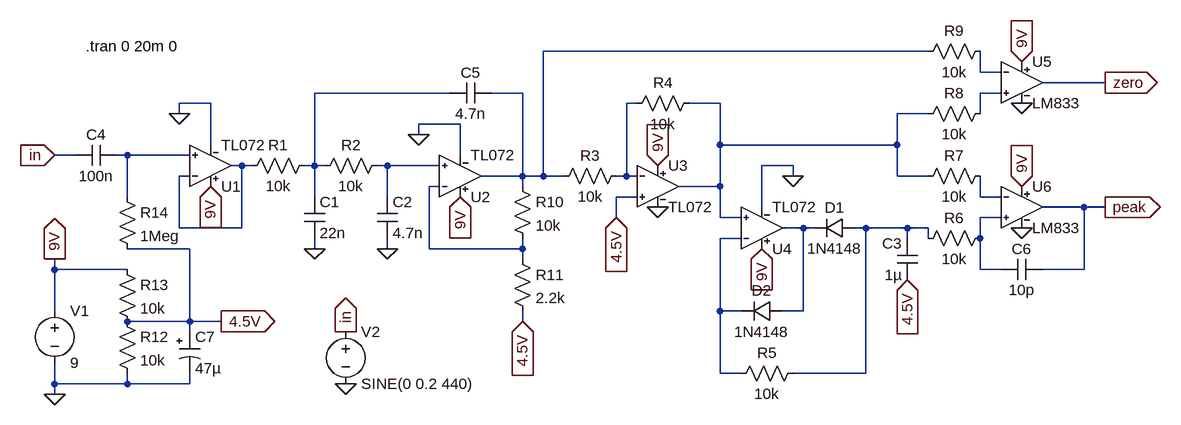
[diagram p0: schematic analyser.asc]
analyser.asc, the LTspice schematic file:
Version 4
SHEET 1 1392 772
WIRE 1024 144 432 144
WIRE 1104 176 1104 144
WIRE 1136 176 1104 176
WIRE 1296 192 1200 192
WIRE 288 208 80 208
WIRE 400 208 352 208
WIRE 1136 208 1104 208
WIRE -80 224 -128 224
WIRE 576 224 560 224
WIRE 704 224 656 224
WIRE -128 240 -128 224
WIRE 1024 240 976 240
WIRE 1104 240 1104 208
WIRE 304 256 240 256
WIRE 240 272 240 256
WIRE -80 288 -80 224
WIRE 704 288 704 224
WIRE 976 288 976 240
WIRE 976 288 704 288
WIRE -288 304 -320 304
WIRE -208 304 -224 304
WIRE -112 304 -208 304
WIRE 304 304 304 256
WIRE -32 320 -48 320
WIRE -16 320 -32 320
WIRE 80 320 80 208
WIRE 80 320 64 320
WIRE 96 320 80 320
WIRE 192 320 176 320
WIRE 272 320 192 320
WIRE 816 320 768 320
WIRE -112 336 -128 336
WIRE 400 336 400 208
WIRE 400 336 336 336
WIRE 432 336 432 144
WIRE 432 336 400 336
WIRE 464 336 432 336
WIRE 560 336 560 224
WIRE 560 336 544 336
WIRE 576 336 560 336
WIRE 816 336 816 320
WIRE 976 336 976 288
WIRE 1024 336 976 336
WIRE 272 352 256 352
WIRE 400 352 400 336
WIRE 704 352 704 288
WIRE 704 352 640 352
WIRE -208 368 -208 304
WIRE 80 368 80 320
WIRE 192 368 192 320
WIRE 576 368 544 368
WIRE 1104 368 1104 336
WIRE 1136 368 1104 368
WIRE 768 384 768 320
WIRE 1264 384 1200 384
WIRE 1296 384 1264 384
WIRE 544 400 544 368
WIRE 704 400 704 352
WIRE 736 400 704 400
WIRE 1136 400 1104 400
WIRE -128 416 -128 336
WIRE -32 416 -32 320
WIRE -32 416 -128 416
WIRE 832 416 800 416
WIRE 848 416 832 416
WIRE 928 416 912 416
WIRE 992 416 928 416
WIRE 1024 416 992 416
WIRE 736 432 704 432
WIRE 992 432 992 416
WIRE 1024 432 1024 416
WIRE 1104 432 1104 400
WIRE -112 448 -208 448
WIRE 80 448 80 432
WIRE 192 448 192 432
WIRE 256 448 256 352
WIRE 400 448 400 432
WIRE 400 448 256 448
WIRE 400 464 400 448
WIRE -320 480 -320 464
WIRE -208 480 -320 480
WIRE 1104 480 1104 432
WIRE 1136 480 1104 480
WIRE 1264 480 1264 384
WIRE 1264 480 1200 480
WIRE -320 544 -320 480
WIRE 704 544 704 432
WIRE 736 544 704 544
WIRE 832 544 832 416
WIRE 832 544 800 544
WIRE -112 560 -112 448
WIRE -112 560 -208 560
WIRE -64 560 -112 560
WIRE 400 560 400 544
WIRE -112 576 -112 560
WIRE 704 640 704 544
WIRE 736 640 704 640
WIRE 928 640 928 416
WIRE 928 640 816 640
WIRE -320 656 -320 624
WIRE -208 656 -208 640
WIRE -208 656 -320 656
WIRE -112 656 -112 640
WIRE -112 656 -208 656
WIRE -320 672 -320 656
FLAG -80 352 9V
IOPIN -80 352 In
FLAG 80 448 0
FLAG 192 448 0
FLAG 304 368 9V
IOPIN 304 368 In
FLAG 400 560 4.5V
IOPIN 400 560 In
FLAG 608 320 9V
IOPIN 608 320 In
FLAG 544 400 4.5V
IOPIN 544 400 In
FLAG 768 448 9V
IOPIN 768 448 In
FLAG 992 496 4.5V
IOPIN 992 496 In
FLAG 1296 192 zero
IOPIN 1296 192 Out
FLAG 1296 384 peak
IOPIN 1296 384 Out
FLAG -320 672 0
FLAG -320 464 9V
IOPIN -320 464 Out
FLAG 1168 160 9V
IOPIN 1168 160 In
FLAG 1168 352 9V
IOPIN 1168 352 In
FLAG 1168 224 0
FLAG 1168 416 0
FLAG 608 384 0
FLAG 240 272 0
FLAG -128 240 0
FLAG 816 336 0
FLAG -64 560 4.5V
IOPIN -64 560 Out
FLAG 128 576 in
IOPIN 128 576 Out
FLAG 128 656 0
FLAG -320 304 in
IOPIN -320 304 In
SYMBOL TL072 -80 384 M180
SYMATTR InstName U1
SYMBOL Res 80 304 R90
WINDOW 0 0 56 VBottom 2
WINDOW 3 32 56 VTop 2
SYMATTR InstName R1
SYMATTR Value 10k
SYMBOL Res 192 304 R90
WINDOW 0 0 56 VBottom 2
WINDOW 3 32 56 VTop 2
SYMATTR InstName R2
SYMATTR Value 10k
SYMBOL TL072 304 400 M180
SYMATTR InstName U2
SYMBOL TL072 608 288 R0
SYMATTR InstName U3
SYMBOL Res 560 320 R90
WINDOW 0 0 56 VBottom 2
WINDOW 3 32 56 VTop 2
SYMATTR InstName R3
SYMATTR Value 10k
SYMBOL TL072 768 480 M180
SYMATTR InstName U4
SYMBOL LM833 1168 128 R0
SYMATTR InstName U5
SYMBOL LM833 1168 320 R0
SYMATTR InstName U6
SYMBOL Cap 64 368 R0
SYMATTR InstName C1
SYMATTR Value 22n
SYMBOL Cap 176 368 R0
SYMATTR InstName C2
SYMATTR Value 4.7n
SYMBOL Res 672 208 R90
WINDOW 0 0 56 VBottom 2
WINDOW 3 32 56 VTop 2
SYMATTR InstName R4
SYMATTR Value 10k
SYMBOL Res 832 624 R90
WINDOW 0 0 56 VBottom 2
WINDOW 3 32 56 VTop 2
SYMATTR InstName R5
SYMATTR Value 10k
SYMBOL Res 1120 416 R90
WINDOW 0 0 56 VBottom 2
WINDOW 3 32 56 VTop 2
SYMATTR InstName R6
SYMATTR Value 10k
SYMBOL Res 1120 320 R90
WINDOW 0 0 56 VBottom 2
WINDOW 3 32 56 VTop 2
SYMATTR InstName R7
SYMATTR Value 10k
SYMBOL Res 1120 224 R90
WINDOW 0 0 56 VBottom 2
WINDOW 3 32 56 VTop 2
SYMATTR InstName R8
SYMATTR Value 10k
SYMBOL Res 1120 128 R90
WINDOW 0 0 56 VBottom 2
WINDOW 3 32 56 VTop 2
SYMATTR InstName R9
SYMATTR Value 10k
SYMBOL Cap 1008 496 R180
WINDOW 0 24 56 Left 2
WINDOW 3 24 8 Left 2
SYMATTR InstName C3
SYMATTR Value 1µ
SYMBOL Cap -224 288 R90
WINDOW 0 0 32 VBottom 2
WINDOW 3 32 32 VTop 2
SYMATTR InstName C4
SYMATTR Value 100n
SYMBOL diode 912 400 R90
WINDOW 0 0 32 VBottom 2
WINDOW 3 32 32 VTop 2
SYMATTR InstName D1
SYMATTR Value 1N4148
SYMBOL diode 800 528 R90
WINDOW 0 0 32 VBottom 2
WINDOW 3 32 32 VTop 2
SYMATTR InstName D2
SYMATTR Value 1N4148
SYMBOL Cap 352 192 R90
WINDOW 0 0 32 VBottom 2
WINDOW 3 32 32 VTop 2
SYMATTR InstName C5
SYMATTR Value 4.7n
SYMBOL Res 384 336 R0
SYMATTR InstName R10
SYMATTR Value 10k
SYMBOL Res 384 448 R0
SYMATTR InstName R11
SYMATTR Value 2.2k
SYMBOL Cap 1200 464 R90
WINDOW 0 0 32 VBottom 2
WINDOW 3 32 32 VTop 2
SYMATTR InstName C6
SYMATTR Value 10p
SYMBOL Voltage -320 528 R0
SYMATTR InstName V1
SYMATTR Value 9
SYMBOL Res -224 544 R0
SYMATTR InstName R12
SYMATTR Value 10k
SYMBOL Res -224 464 R0
SYMATTR InstName R13
SYMATTR Value 10k
SYMBOL Voltage 128 560 R0
SYMATTR InstName V2
SYMATTR Value SINE(0 0.2 440)
SYMBOL polcap -128 576 R0
SYMATTR InstName C7
SYMATTR Value 47µ
SYMBOL Res -224 352 R0
SYMATTR InstName R14
SYMATTR Value 1Meg
TEXT -272 136 Left 2 !.tran 0 20m 0

The netlist it stands for:
* analyser.asc
XU1 N007 N008 9V 0 N008 TL072  ; pins In+ In- V+ V- OUT
R1 N003 N008 10k
R2 N009 N003 10k
XU2 N009 N010 9V 0 N001 TL072  ; pins In+ In- V+ V- OUT
XU3 4.5V N005 9V 0 N006 TL072  ; pins In+ In- V+ V- OUT
R3 N005 N001 10k
XU4 N006 N015 9V 0 N013 TL072  ; pins In+ In- V+ V- OUT
XU5 N004 N002 9V 0 zero LM833  ; pins In+ In- V+ V- OUT
XU6 N012 N011 9V 0 peak LM833  ; pins In+ In- V+ V- OUT
C1 N003 0 22n
C2 N009 0 4.7n
R4 N006 N005 10k
R5 N014 N015 10k
R6 N012 N014 10k
R7 N011 N006 10k
R8 N004 N006 10k
R9 N002 N001 10k
C3 4.5V N014 1µ
C4 N007 in 100n
D1 N014 N013 1N4148
D2 N013 N015 1N4148
C5 N001 N003 4.7n
R10 N001 N010 10k
R11 N010 4.5V 2.2k
C6 peak N012 10p
V1 9V 0 9
R12 4.5V 0 10k
R13 9V 4.5V 10k
V2 in 0 SINE(0 0.2 440)
C7 4.5V 0 47µ
R14 N007 4.5V 1Meg
.model D D
.lib standard.dio
.tran 0 20m 0
.lib TL072.sub
.lib LM833.sub
.backanno
.end